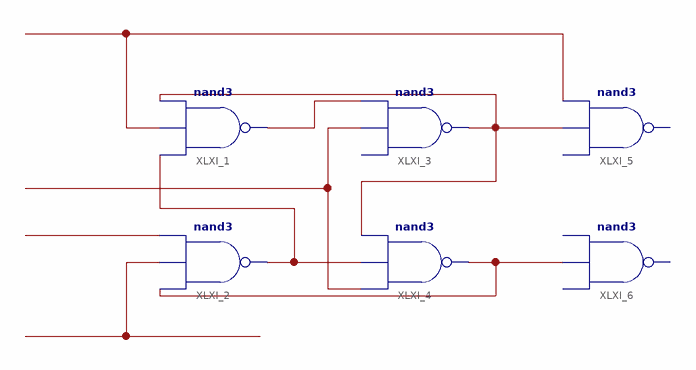
[diagram p0: schematic sheet 1]
// Xilinx ISE schematic MB_DFF.sch (kintex7) as structural Verilog: 6 symbols, 0 ports
module MB_DFF (
);

  wire XLXN_1, XLXN_3, XLXN_7, XLXN_9, XLXN_11, XLXN_13, XLXN_14, XLXN_16;

  nand XLXI_1 (XLXN_3, XLXN_9, XLXN_1, XLXN_7);
  nand XLXI_3 (XLXN_7, XLXN_11, XLXN_3);  // open: I0
  // nand3 XLXI_5 has open pins: I0=open, I1=XLXN_7, I2=XLXN_1, O=open
  nand XLXI_2 (XLXN_9, XLXN_13, XLXN_16, XLXN_14);
  nand XLXI_4 (XLXN_13, XLXN_11, XLXN_9, XLXN_7);
  // nand3 XLXI_6 has open pins: I0=open, I1=XLXN_13, I2=open, O=open
endmodule
